# EAGLE design Audio Lights (EAGLE 9.2.0)
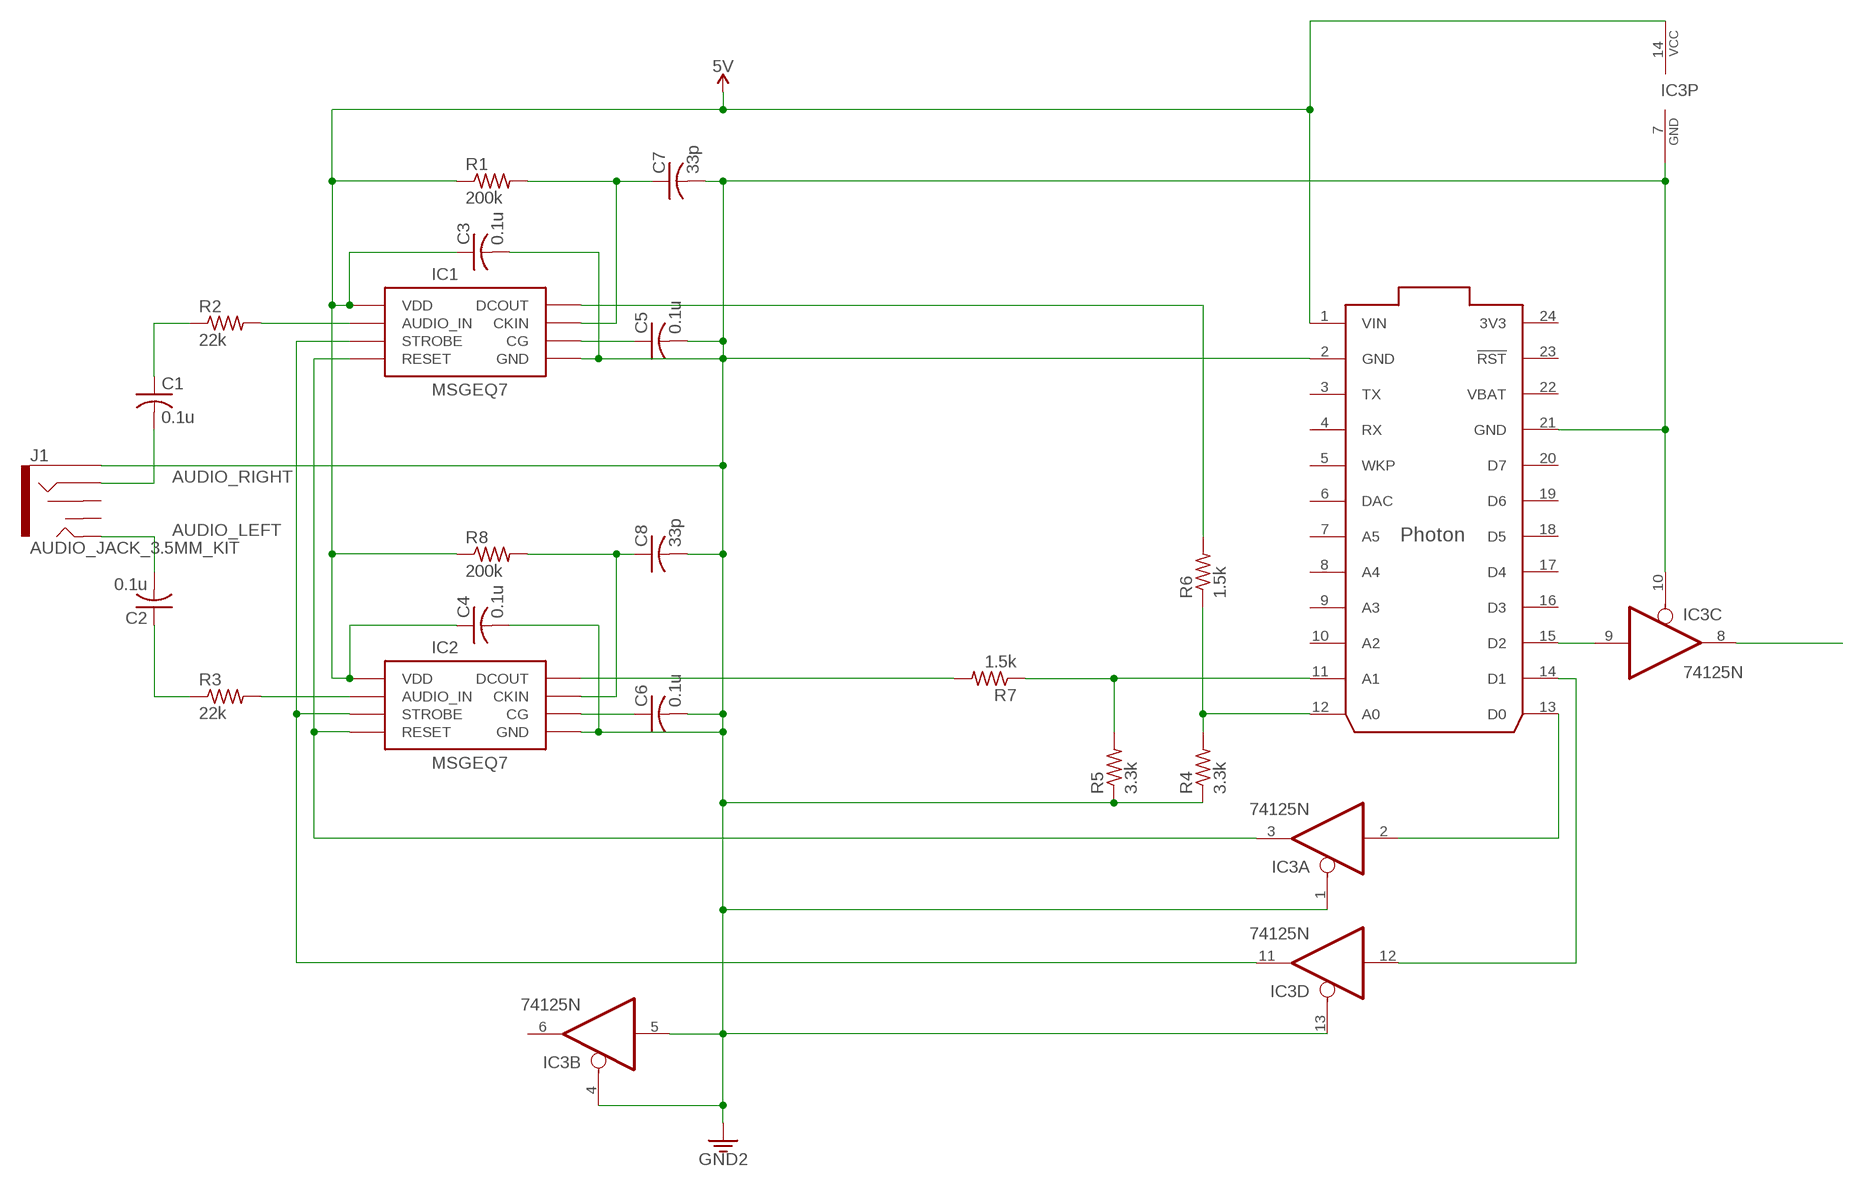
[diagram p0: schematic, sheet 1]

## Parts
C1  0.1u  C-US025-024X044  [C025-024X044]
C2  0.1u  C-US025-024X044  [C025-024X044]
C3  0.1u  C-US025-024X044  [C025-024X044]
C4  0.1u  C-US025-024X044  [C025-024X044]
C5  0.1u  C-US025-024X044  [C025-024X044]
C6  0.1u  C-US025-024X044  [C025-024X044]
C7  33p  C-US050-045X075  [C050-045X075]
C8  33p  C-US050-045X075  [C050-045X075]
IC1  MSGEQ7P  MSGEQ7DIL  [DIP08]
IC2  MSGEQ7P  MSGEQ7DIL  [DIP08]
IC3  74125N  [DIL14]
J1  AUDIO_JACK_3.5MM_KIT  [AUDIO-JACK-KIT]
R1  200k  R-US_0204/7  [0204/7]
R2  22k  R-US_0204/7  [0204/7]
R3  22k  R-US_0204/7  [0204/7]
R4  3.3k  R-US_0204/5  [0204/5]
R5  3.3k  R-US_0204/5  [0204/5]
R6  1.5k  R-US_0204/5  [0204/5]
R7  1.5k  R-US_0204/5  [0204/5]
R8  200k  R-US_0204/7  [0204/7]
U$1  PHOTON_WITH_HEADERS  [PHOTON]

## Nets
5V: C3.1 C4.1 IC1.1(VDD) IC2.1(VDD) IC3.14(P:VCC) R1.1 R8.1 U$1.1(VIN)
AGND_LEFT: C6.1 IC2.6(CG)
AGND_RIGHT: C5.1 IC1.6(CG)
AUDIO_IN_LEFT: IC2.5(AUDIO_IN) R3.2
AUDIO_IN_RIGHT: IC1.5(AUDIO_IN) R2.2
AUDIO_LEFT: C2.2 J1.TIP
AUDIO_RIGHT: C1.2 J1.RING
CLK_LEFT: C8.1 IC2.8(CKIN) R8.2
CLK_RIGHT: C7.1 IC1.8(CKIN) R1.2
DOUT_LEFT3V3: R5.2 R7.1 U$1.11(A1)
DOUT_LEFT5V: IC2.3(DCOUT) R7.2
DOUT_RIGHT3V3: R4.2 R6.1 U$1.12(A0)
DOUT_RIGHT5V: IC1.3(DCOUT) R6.2
GND: C3.2 C4.2 C5.2 C6.2 C7.2 C8.2 IC1.2(GND) IC2.2(GND) IC3.1(A:OE) IC3.4(B:OE) IC3.5(B:I) IC3.7(P:GND) IC3.10(C:OE) IC3.13(D:OE) J1.SLEEVE R4.1 R5.1 U$1.2(GND) U$1.21(GND) ; supply symbol labelled GND2
LED_3.3V: IC3.9(C:I) U$1.15(D2)
LED_5V: IC3.8(C:O)
N$1: C2.1 R3.1
N$3: C1.1 R2.1
RESET_3.3V: IC3.2(A:I) U$1.13(D0)
RESET_5V: IC1.7(RESET) IC2.7(RESET) IC3.3(A:O)
STROBE_3.3V: IC3.12(D:I) U$1.14(D1)
STROBE_5V: IC1.4(STROBE) IC2.4(STROBE) IC3.11(D:O)
Unconnected: IC3.6(B:O) J1.RSH J1.TSH U$1.3(TX) U$1.4(RX) U$1.5(WKP) U$1.6(DAC) U$1.7(A5) U$1.8(A4) U$1.9(A3) U$1.10(A2) U$1.16(D3) U$1.17(D4) U$1.18(D5) U$1.19(D6) U$1.20(D7) U$1.23(!RST)

## Power pins joined to a net without a drawn wire
3V3: U$1.24(3V3)
VBAT: U$1.22(VBAT)

## Library data of the parts
C1-C8 = rcl:C-US: CAPACITOR, American symbol; SPICEPREFIX: C
IC1 IC2 = SparkFun-IC-Special-Function:MSGEQ7: 7-band graphic equalizer This IC is for making a 7 band/channel audio spectrometer. There are two versions of this part. The DIP available on the storefront, and the SO used in product. Datasheet <https://www.sparkfun.com/datasheets/Components/General/MSGEQ7.pdf> SparkFun Products Storefront component: Graphic Equalizer Display Filter - MSGEQ7 <https://www.sparkfun.com/products/10468> (COM-10468) SparkFun Spectrum Shield <https://www.sparkfun.com/products/13116> (DEV-13116); PROD_ID: IC-12196
IC3 = 74xx-us:74*125: Quad bus BUFFER, 3-state
J1 = SparkFun-Connectors:AUDIO_JACK_3.5MM: Audio Jack 3.5mm variants of PTH and SMT stereo audio jack with bypass switches. SparkFun Products: SparkFun SparkPunk Sound Kit <[https://www.sparkfun.com/products/11177]> - PTH MP3 Trigger <https://www.sparkfun.com/products/13720> -3.5mm SMD SparkFun PicoBoard <https://www.sparkfun.com/products/11888>- 2.5mm SMD; PROD_ID: CONN-08774; SF_ID: PRT-08032
R1-R8 = rcl:R-US_: RESISTOR, American symbol; SPICEPREFIX: R
U$1 = Particle-Devices:PHOTON: Particle Photon Wi-Fi through-hole development board footprint Product datasheet: here <https://docs.particle.io/datasheets/photon-(wifi)/photon-datasheet/> Design files: here <https://github.com/particle-iot/photon> Github : Particle devices library <https://github.com/particle-iot/hardware-libraries/tree/master/Eagle>

## Net classes
0 default: width 0.102 mm, clearance 0.102 mm

## Board
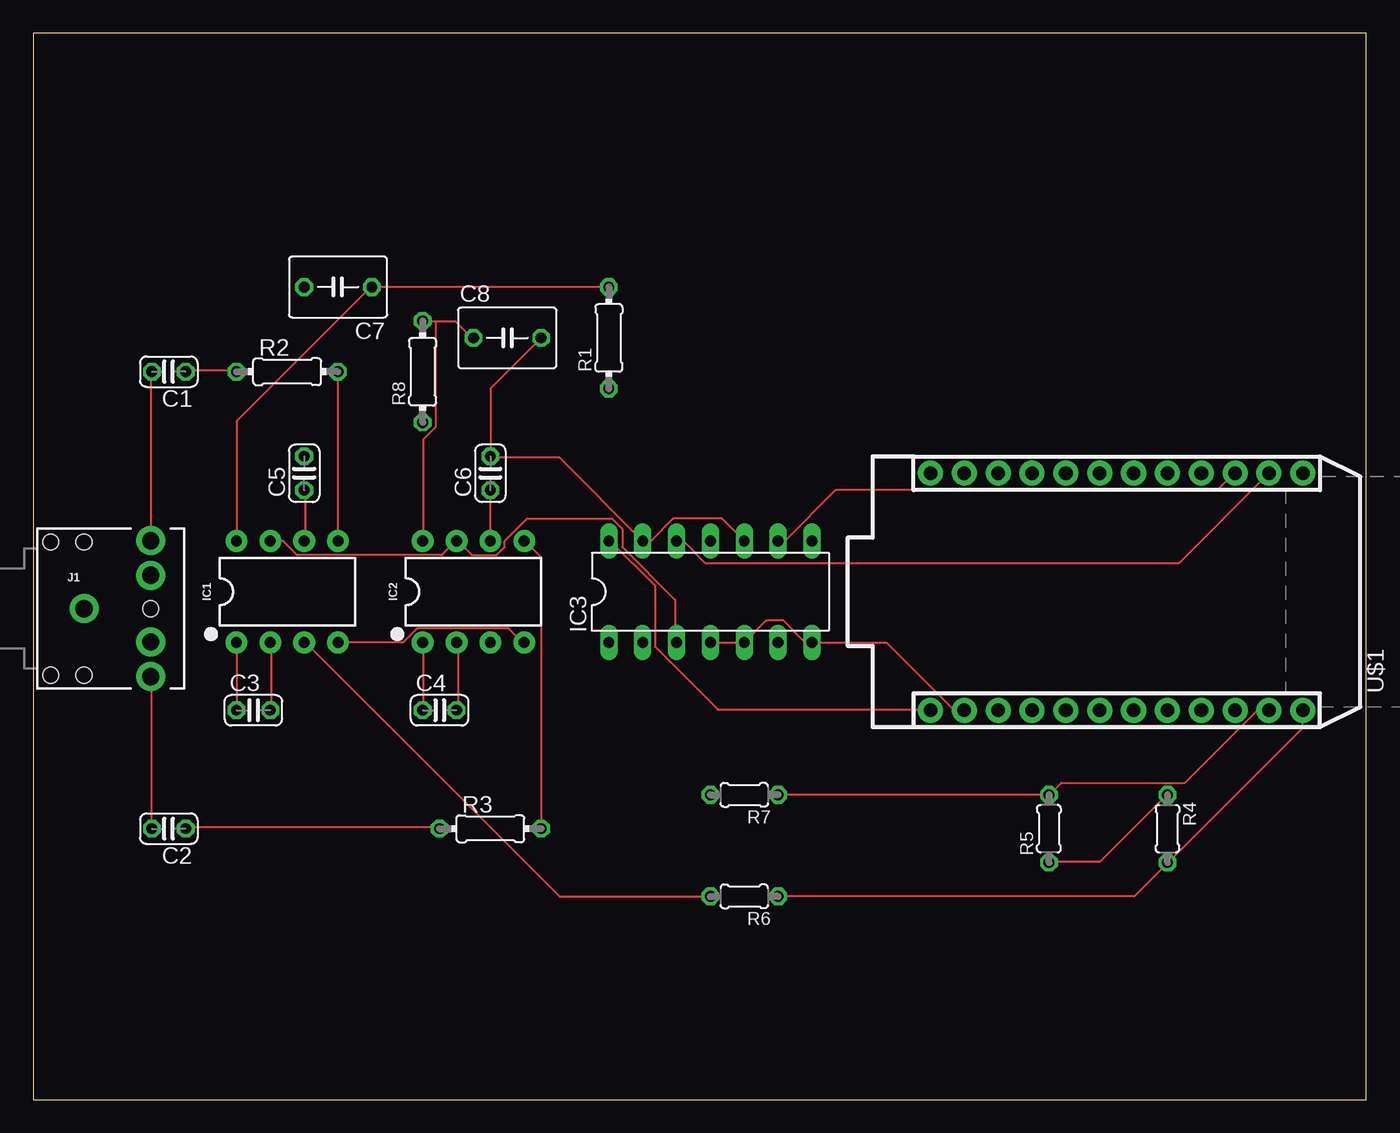
[diagram p1: board, top side]
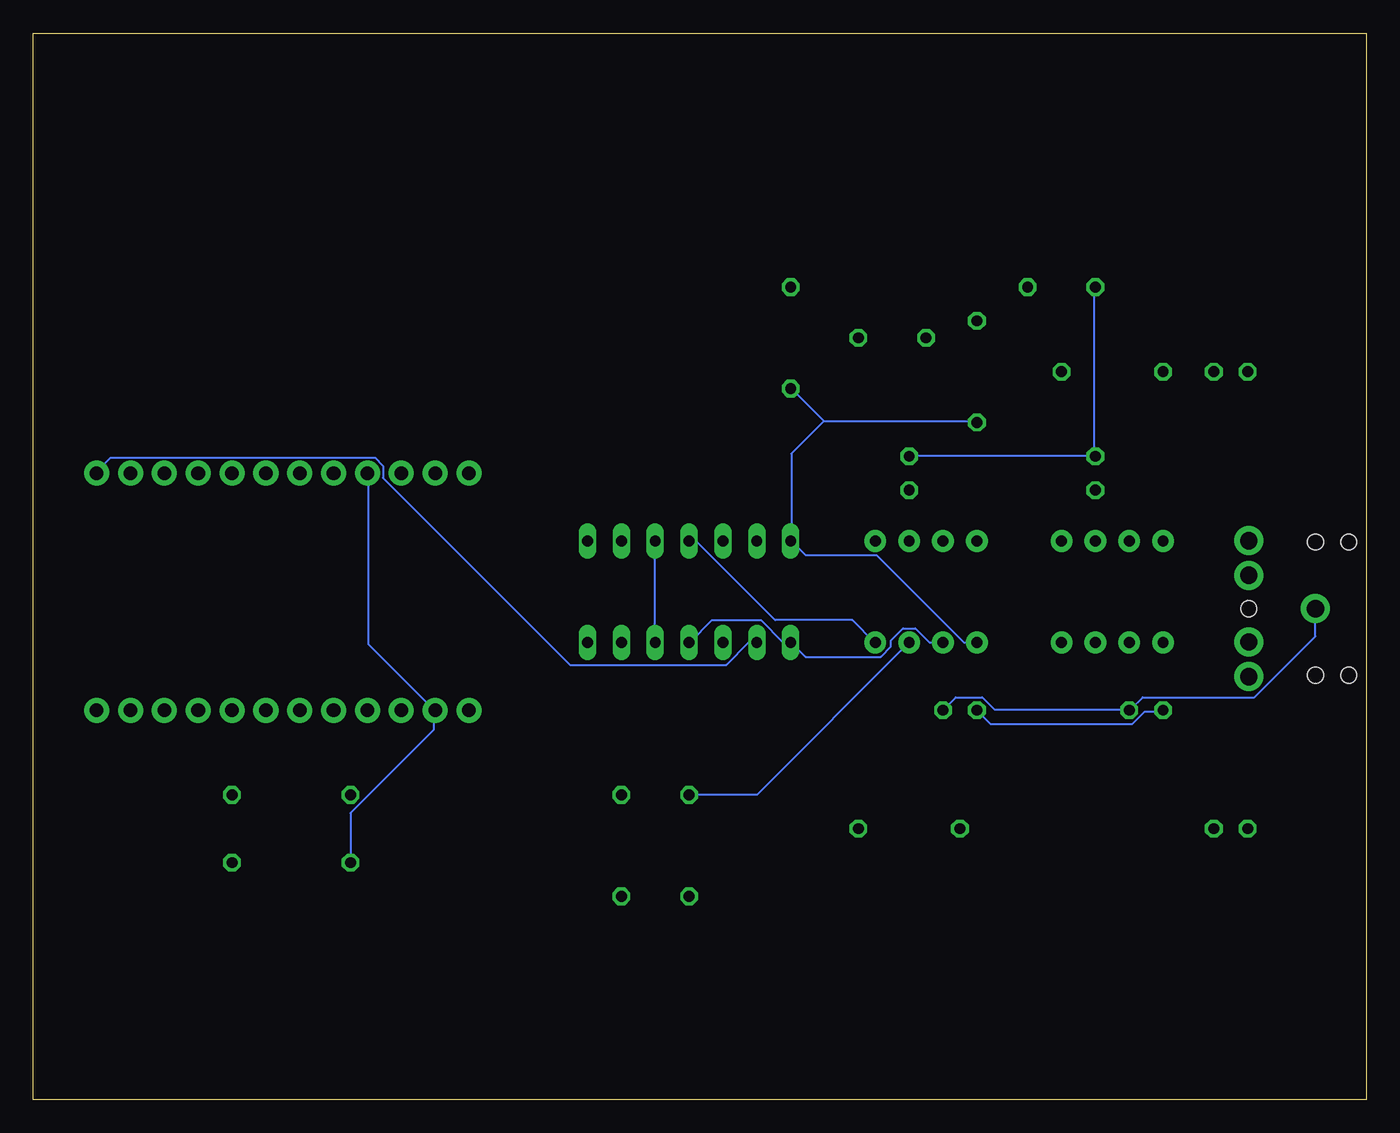
[diagram p2: board, bottom side, seen from below]

Size 100 x 80 mm. Coordinates in mm from the lower left corner, seen from the top.
Outline: 0,0 100,0 100,80 0,80 0,0
Copper layers (1*16): Top 0.035mm / dielectric 1.5mm / Bottom 0.035mm
Design rules "default": minimum track width 6mil, minimum drill 0.35mm, track to track 6mil, track to pad 6mil, pad to pad 6mil, via to via 6mil, smd to smd 6mil, copper to edge 40mil, drill to drill 6mil, minimum pad ring 10mil, minimum via ring 8mil, stop-mask expansion 4mil, vias tented up to drill 0mil, thermal gap 10mil

### Footprints (pad centres in the part's own frame; a part is rotated, then mirrored left to right if it is on the bottom)
C025-024X044 = drill 0.813 octagon: 1 -1.27,0; 2 1.27,0
C050-045X075 = drill 0.813 octagon: 1 -2.54,0; 2 2.54,0
DIP08 = drill 0.813 pad 1.626: 1 -3.81,-3.81; 2 -1.27,-3.81; 3 1.27,-3.81; 4 3.81,-3.81; 5 3.81,3.81; 6 1.27,3.81; 7 -1.27,3.81; 8 -3.81,3.81
DIL14 = drill 0.813 long: 1 -7.62,-3.81; 2 -5.08,-3.81; 3 -2.54,-3.81; 4 0,-3.81; 5 2.54,-3.81; 6 5.08,-3.81; 7 7.62,-3.81; 8 7.62,3.81; 9 5.08,3.81; 10 2.54,3.81; 11 0,3.81; 12 -2.54,3.81; 13 -5.08,3.81; 14 -7.62,3.81
AUDIO-JACK-KIT = drill 1.3 pad 2.184: RING 5,5.1; RSH 5,2.5; SLEEVE 0,0; TIP 5,-5.1; TSH 5,-2.5 | hole 1.2: 0,5; -2.5,5; -2.5,-5; 0,-5; 5,0
0204/7 = drill 0.813 octagon: 1 -3.81,0; 2 3.81,0
0204/5 = drill 0.813 octagon: 1 -2.54,0; 2 2.54,0
PHOTON = drill 1.016 pad 1.88: 1 1.27,33.02; 2 1.27,30.48; 3 1.27,27.94; 4 1.27,25.4; 5 1.27,22.86; 6 1.27,20.32; 7 1.27,17.78; 8 1.27,15.24; 9 1.27,12.7; 10 1.27,10.16; 11 1.27,7.62; 12 1.27,5.08; 13 19.05,5.08; 14 19.05,7.62; 15 19.05,10.16; 16 19.05,12.7; 17 19.05,15.24; 18 19.05,17.78; 19 19.05,20.32; 20 19.05,22.86; 21 19.05,25.4; 22 19.05,27.94; 23 19.05,30.48; 24 19.05,33.02

### Placement (x,y rotation side)
C1  10.16,54.61 180 top
C2  10.16,20.32 180 top
C3  16.51,29.21 0 top
C4  30.48,29.21 0 top
C5  20.32,46.99 90 top
C6  34.29,46.99 90 top
C7  22.86,60.96 180 top
C8  35.56,57.15 0 top
IC1  19.05,38.1 0 top
IC2  33.02,38.1 0 top
IC3  50.8,38.1 0 top
J1  3.81,36.83 0 top
R1  43.18,57.15 90 top
R2  19.05,54.61 0 top
R3  34.29,20.32 0 top
R4  85.09,20.32 270 top
R5  76.2,20.32 90 top
R6  53.34,15.24 180 top
R7  53.34,22.86 180 top
R8  29.21,54.61 90 top
U$1  100.33,27.94 90 top

### Tracks (layer width: path | path; a pad name or v marks a point on that pad's centre or on a via)
5V
  Top 0.152: IC1.1 C3.1 | C4.1 29.26,29.26 29.26,34.29 IC2.1 | U$1.1 67.21,29.26 51.36,29.26 46.63,33.98 46.63,38.56 43.28,41.91 IC3.14
  Bottom 0.152: C4.1 28.19,28.19 17.53,28.19 16.61,29.11 15.24,29.11 C3.1 | 40.69,50.9 29.26,50.9 R8.1 | 40.69,50.9 43.13,53.34 R1.1 | 43.13,41.91 43.13,48.46 40.69,50.9 | IC2.1 30.18,34.29 36.73,40.84 42.06,40.84 43.13,41.91 | 43.13,41.91 IC3.14
AGND_LEFT
  Top 0.152: IC2.6 C6.1
AGND_RIGHT
  Top 0.152: C5.1 20.42,45.72 20.42,41.91 IC1.6
AUDIO_IN_LEFT
  Top 0.152: R3.2 38.1,40.69 36.88,41.91 IC2.5
AUDIO_IN_RIGHT
  Top 0.152: IC1.5 R2.2
AUDIO_LEFT
  Top 0.152: C2.2 8.84,20.42 8.84,31.7 J1.TIP
AUDIO_RIGHT
  Top 0.152: C1.2 8.84,54.56 8.84,42.06 J1.RING
CLK_LEFT
  Top 0.152: 30.18,58.37 31.7,58.37 32.92,57.15 C8.1 | 30.18,58.37 29.26,58.37 R8.2 | 30.18,58.37 30.18,50.44 29.26,49.53 29.26,41.91 IC2.8
CLK_RIGHT
  Top 0.152: R1.2 C7.1 25.3,60.96 15.24,50.9 IC1.8
DOUT_LEFT3V3
  Top 0.152: R7.1 R5.2 77.11,23.77 86.41,23.77 91.75,29.11 92.66,29.11 U$1.11
DOUT_LEFT5V
  Bottom 0.152: R7.2 45.72,22.86 IC2.3
DOUT_RIGHT3V3
  Top 0.152: R6.1 82.6,15.24 85.04,17.68 R4.2 85.19,17.83 95.25,27.89 U$1.12
DOUT_RIGHT5V
  Top 0.152: R6.2 39.47,15.24 20.42,34.29 IC1.3
GND
  Top 0.152: C8.2 34.29,53.34 C6.2 34.29,48.16 39.47,48.16 IC3.13 46.33,41.91 48.01,43.59 51.66,43.59 IC3.10 | C3.2 17.83,29.26 17.83,34.29 IC1.2 | R5.1 76.2,17.83 80.01,17.83 85.04,22.86 R4.1 | C4.2 31.85,29.26 31.85,34.29 IC2.2 | IC3.4 IC3.5 55.02,35.97 56.24,35.97 57.91,34.29 IC3.7 64.01,34.29 69.04,29.26 69.8,29.26 U$1.2
  Bottom 0.152: 20.42,48.31 20.42,60.96 C7.2 | 20.42,48.31 34.29,48.31 C6.2 | 20.42,48.31 C5.2 | J1.SLEEVE 3.81,34.75 8.38,30.18 16.76,30.18 17.68,29.26 C3.2 17.83,29.26 27.89,29.26 28.8,30.18 30.79,30.18 C4.2 | IC3.4 50.75,34.29 49.07,35.97 45.41,35.97 43.74,34.29 IC3.1 43.13,34.29 42.06,33.22 36.42,33.22 35.66,33.98 35.66,34.44 34.75,35.36 33.83,35.36 32.77,34.29 IC2.2 | U$1.21 74.83,46.94 74.83,34.14 69.95,29.26 U$1.2 69.95,29.11 69.95,27.74 76.2,21.49 R5.1 | IC3.5 IC3.10
LED_3.3V
  Top 0.152: IC3.9 56.39,41.91 60.2,45.72 88.85,45.72 90.07,46.94 U$1.15
N$1
  Top 0.152: C2.1 11.43,20.42 30.48,20.42 R3.1
N$3
  Top 0.152: C1.1 11.43,54.71 15.24,54.71 R2.1
RESET_3.3V
  Bottom 0.152: IC3.2 46.33,34.29 48.01,32.61 59.74,32.61 73.76,46.63 73.76,47.55 74.37,48.16 94.18,48.16 95.25,47.09 U$1.13
RESET_5V
  Top 0.152: IC3.3 48.16,34.29 48.16,37.49 44.2,41.45 44.2,42.82 43.43,43.59 37.03,43.59 35.36,41.91 35.36,41.45 34.75,40.84 32.92,40.84 31.85,41.91 IC2.7 31.7,41.91 30.63,40.84 19.81,40.84 18.75,41.91 IC1.7
STROBE_3.3V
  Top 0.152: IC3.12 48.77,41.91 50.44,40.23 85.95,40.23 U$1.14
STROBE_5V
  Top 0.152: IC1.4 27.74,34.29 28.8,35.36 35.66,35.36 36.73,34.29 IC2.4
  Bottom 0.152: IC3.11 50.29,41.91 44.35,35.97 38.56,35.97 36.88,34.29 IC2.4